# Altium schematic sheet LEDS.SchDoc
size A; DocumentNumber: 4; SheetNumber: 4; SheetTotal: 6
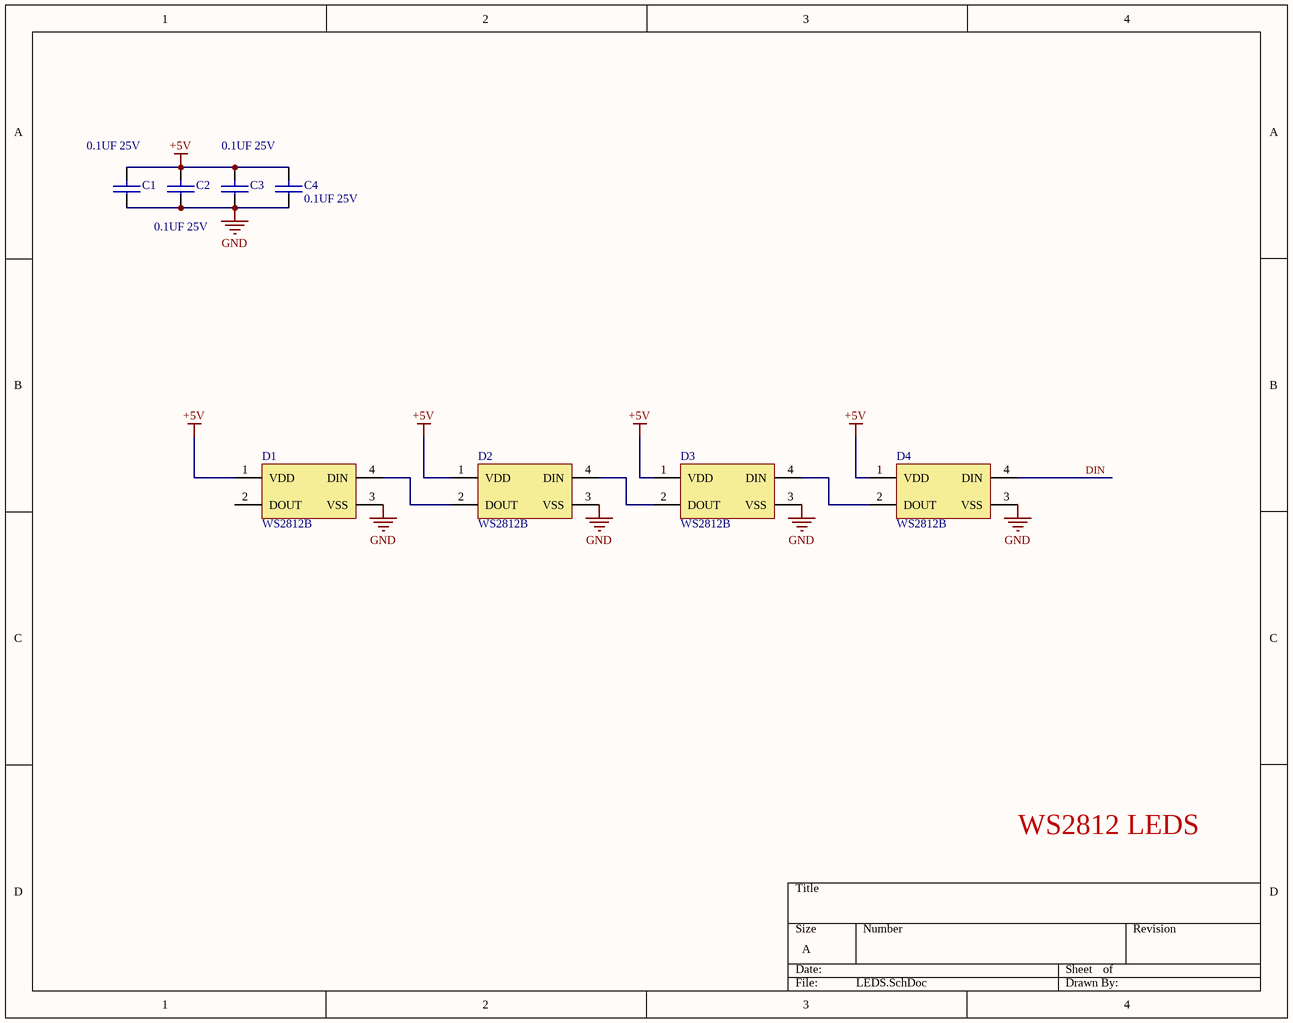
[diagram p0: LEDS.SchDoc]

## Parts
C1  0.1UF 25V  [C0603]
C2  0.1UF 25V  [C0603]
C3  0.1UF 25V  [C0603]
C4  0.1UF 25V  [C0603]
D1  WS2812B  [ws2812b]
D2  WS2812B  [ws2812b]
D3  WS2812B  [ws2812b]
D4  WS2812B  [ws2812b]

## Nets
+5V: C1.2 C2.2 C3.2 C4.2 D1.1(VDD) D2.1(VDD) D3.1(VDD) D4.1(VDD)
GND: C1.1 C2.1 C3.1 C4.1 D1.3(VSS) D2.3(VSS) D3.3(VSS) D4.3(VSS)
DIN: D4.4(DIN)
NetD1_4: D1.4(DIN) D2.2(DOUT)
NetD2_4: D2.4(DIN) D3.2(DOUT)
NetD3_4: D3.4(DIN) D4.2(DOUT)

Not connected (* = marked no-connect by the designer): D1 2(DOUT)

## Notes on the sheet
- WS2812 LEDS

## Library data of the parts
C1-C4 = 06033D104KAT2A: CAP CER 0.1UF 25V X5R 0603; Manufacturer: Kyocera AVX; Capacitance: 100 nF; Tolerance (%): ±10 %; Supplier 1: Digi-Key; Manufacturer Part Number: 06033D104KAT2A; Stock 1: 0; Pricing 1: 1=0.32, 10=0.221, 100=0.1328, 500=0.0996, 1000=0.0841 (USD); Case Size/Dimension: 0603; Dielectric: X5R; Rated Voltage: 25 V; ComponentLink1URL: https://datasheet.ciiva.com/19475/1031061-19475906.pdf; ComponentLink1Description: https://datasheet.ciiva.com/19475/1031061-19475906.pdf; ComponentLink2URL: https://datasheet.ciiva.com/28613/759405-28613274.pdf; ComponentLink2Description: https://datasheet.ciiva.com/28613/759405-28613274.pdf; ComponentLink3URL: https://datasheet.ciiva.com/16397/cx5r-16397162.pdf; ComponentLink3Description: https://datasheet.ciiva.com/16397/cx5r-16397162.pdf; ComponentLink4URL: https://datasheet.ciiva.com/28613/1666675-28613037.pdf; ComponentLink4Description: https://datasheet.ciiva.com/28613/1666675-28613037.pdf; ComponentLink5URL: https://datasheet.ciiva.com/28613/1666675-28613275.pdf; ComponentLink5Description: https://datasheet.ciiva.com/28613/1666675-28613275.pdf; ComponentLink6URL: https://datasheet.ciiva.com/152/cx5r-152227.pdf; ComponentLink6Description: https://datasheet.ciiva.com/152/cx5r-152227.pdf; ComponentLink7URL: https://datasheet.ciiva.com/152/cx5r-152226.pdf; ComponentLink7Description: https://datasheet.ciiva.com/152/cx5r-152226.pdf; ComponentLink8URL: https://datasheet.ciiva.com/2987/cx5r-2987761.pdf; ComponentLink8Description: https://datasheet.ciiva.com/2987/cx5r-2987761.pdf; ComponentLink9URL: https://datasheet.ciiva.com/152/cx5r-152225.pdf; ComponentLink9Description: https://datasheet.ciiva.com/152/cx5r-152225.pdf; ComponentLink10URL: https://datasheet.ciiva.com/2987/cx5r-2987762.pdf; ComponentLink10Description: https://datasheet.ciiva.com/2987/cx5r-2987762.pdf; Supplier Part Number 1: 478-1244-6-ND
D1-D4 = WS2812B: LED RGB WS2812 OR SK6812 1=10; Manufacturer: Adafruit Industries LLC; Manufacturer Part Number: 1655; Configuration: Discrete; Number of LEDs: 10; Color: Red, Green, Blue (RGB); Utilized LED: SK6812 or WS2812; Interface: Serial (Shift Register); Supplier 1: Digi-Key; RoHS: RoHS Compliant; Category: Optoelectronics; Stock 1: 8293; Pricing 1: 1=4.5 (USD); Part Status: Active; Controller Type: -; Mounting Type: Surface Mount; Size / Dimension: 5.00mm L x 5.00mm W; ComponentLink1URL: https://cdn-shop.adafruit.com/product-files/1138/SK6812+LED+datasheet+.pdf; ComponentLink1Description: https://cdn-shop.adafruit.com/product-files/1138/SK6812+LED+datasheet+.pdf; Supplier Part Number 1: 1528-1104-ND